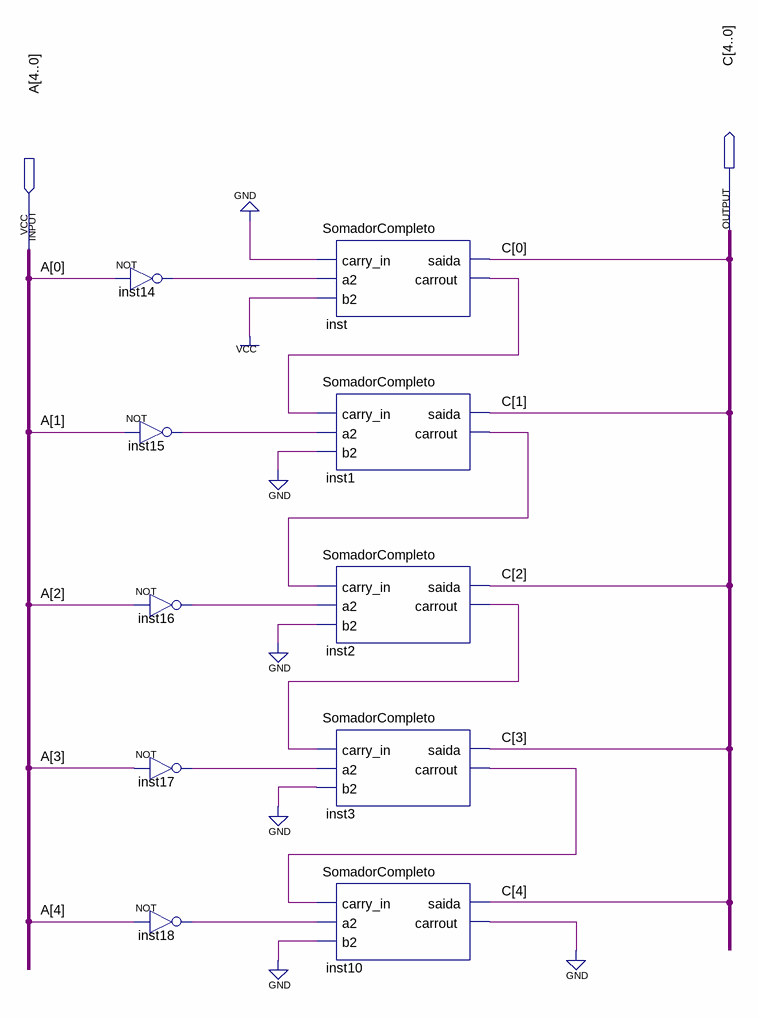
[diagram p0: schematic sheet]
// Quartus schematic Comp2-5.bdf as structural Verilog: 10 symbols, 2 pins
module \Comp2-5  (
  input  [4:0] A,
  output [4:0] C
);

  wire inst1_carrout, inst2_carrout, inst3_carrout, inst10_carrout, inst14_out, inst15_out, inst16_out,
       inst17_out, inst18_out, inst_carrout;

  not inst14 (inst14_out, A[0]);
  not inst15 (inst15_out, A[1]);
  not inst16 (inst16_out, A[2]);
  not inst17 (inst17_out, A[3]);
  not inst18 (inst18_out, A[4]);
  SomadorCompleto inst (.carry_in(1'b0), .a2(inst14_out), .b2(1'b1), .saida(C[0]), .carrout(inst_carrout));
  SomadorCompleto inst1 (.carry_in(inst_carrout), .a2(inst15_out), .b2(1'b0), .saida(C[1]), .carrout(inst1_carrout));
  SomadorCompleto inst2 (.carry_in(inst1_carrout), .a2(inst16_out), .b2(1'b0), .saida(C[2]), .carrout(inst2_carrout));
  SomadorCompleto inst3 (.carry_in(inst2_carrout), .a2(inst17_out), .b2(1'b0), .saida(C[3]), .carrout(inst3_carrout));
  SomadorCompleto inst10 (.carry_in(inst3_carrout), .a2(inst18_out), .b2(1'b0), .saida(C[4]), .carrout(inst10_carrout));
  // also tied to GND on the sheet: inst10_carrout
endmodule
